# Altium schematic sheet trace_6.SchDoc
size A4; SheetNumber: 1; SheetTotal: 1
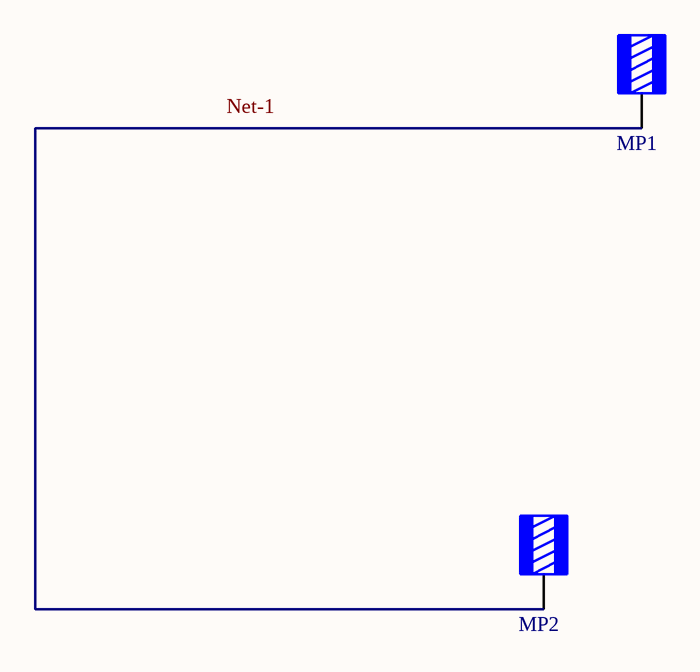
[diagram p0: trace_6.SchDoc]

## Parts
MP1  74651194R  [WURTH 74651194]  (value not drawn)
MP2  74650074R  [WURTH 74650074]  (value not drawn)

## Nets
NetMP1_1: MP1.1 MP2.1

## Notes on the sheet
- Labels drawn without touching a wire or pin: Net-1
- TITLE:
- DOCUMENT NAME:
- AUTHOR :
- REVIEWER:
- This document is created by/ for Mitai. Any further questions can be asked through
- Sheet
- PART NO.:
- of
- DATE:
- *
- TEMPLATE:
- team@mitai.ai.
- A4
- Contact Address:Rosenheimer Straße 116b,81669, München.

## Library data of the parts
MP1 = 74651194R: TERM REDCUBE 9PIN PCB; Manufacturer: Würth Elektronik; Current Rating (Amps): 85 A; Part Number: 74651194R; ComponentLink1Description: Datasheet; ComponentLink1URL: https://katalog.we-online.de/em/datasheet/74651194R.pdf; ComponentLink2Description: DigiKey Link; ComponentLink2URL: https://www.digikey.com/en/products/detail/würth-elektronik/74651194R/6644003; LastUpdated: 07/08/2022 21:20:29; Lifecycle Status: Active; Minimum Order: 1; Mounting Type: Through Hole; Number of Pins: 9; Packaging: TapeAndReel; Part Status: Active; Price: 2.24; Series: REDCUBE WP-THRSH; Supplier 1: DigiKey; Supplier Part Number 1: 732-10907-1-ND; Terminal Type: Shank Terminal; Termination: Solder
MP2 = 74650074R: TERM REDCUBE M4 4PIN PCB; Manufacturer: Würth Elektronik; Current Rating (Amps): 50 A; Part Number: 74650074R; ComponentLink1Description: Datasheet; ComponentLink1URL: https://katalog.we-online.de/em/datasheet/74650074R.pdf; ComponentLink2Description: DigiKey Link; ComponentLink2URL: https://www.digikey.com/en/products/detail/würth-elektronik/74650074R/6643979; Features: Screw not Included; LastUpdated: 07/08/2022 20:40:07; Lifecycle Status: Active; Minimum Order: 1; Mounting Type: Through Hole; Number of Pins: 4; Packaging: TapeAndReel; Part Status: Active; Price: 2.38; Screw Size: M4; Series: REDCUBE WP-THRBU; Supplier 1: DigiKey; Supplier Part Number 1: 732-10883-1-ND; Terminal Type: Screw Terminal, Power Tap; Termination: Solder